# Altium schematic sheet Sheet1.SchDoc
size A; SheetNumber: 1; SheetTotal: 7
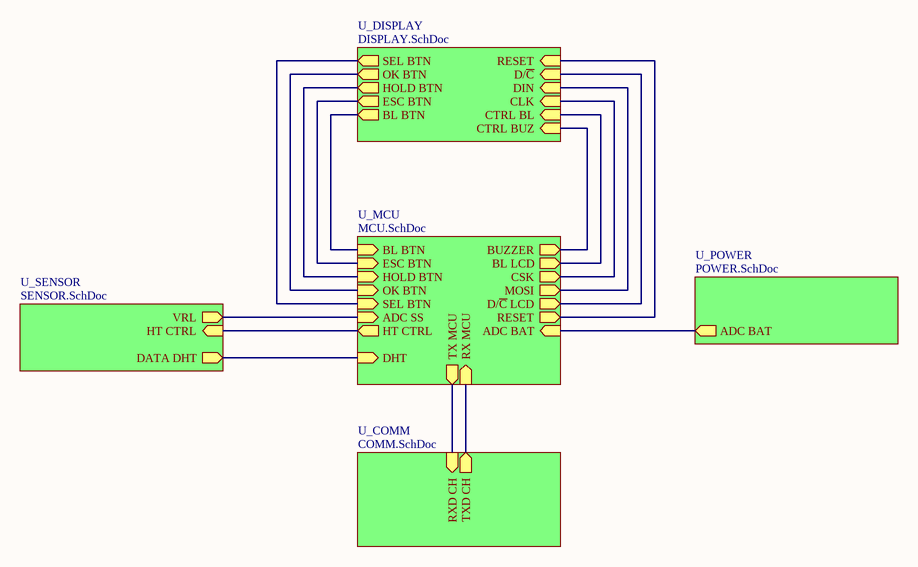
[diagram p0: Sheet1.SchDoc]

## Sub-sheets
U_COMM = COMM.SchDoc: TXD CH (out), RXD CH (in)
U_DISPLAY = DISPLAY.SchDoc: RESET (in), D/~{C} (in), DIN (in), CLK (in), BL BTN (out), ESC BTN (out), HOLD BTN (out), OK BTN (out), SEL BTN (out), CTRL BL (in), CTRL BUZ (in)
U_MCU = MCU.SchDoc: BL BTN (in), ESC BTN (in), HOLD BTN (in), OK BTN (in), SEL BTN (in), BL LCD (out), CSK (out), MOSI (out), D/~{C} LCD (out), ADC SS (in), ADC BAT (in), RESET (out), BUZZER (out), HT CTRL (out), TX MCU (out), RX MCU (in), DHT (in)
U_POWER = POWER.SchDoc: ADC BAT (out)
U_SENSOR = SENSOR.SchDoc: VRL (out), HT CTRL (in), DATA DHT (out)

## Nets
(unnamed): sheet U_POWER/ADC BAT, sheet U_MCU/ADC BAT
(unnamed): sheet U_SENSOR/VRL, sheet U_MCU/ADC SS
(unnamed): sheet U_SENSOR/HT CTRL, sheet U_MCU/HT CTRL
(unnamed): sheet U_SENSOR/DATA DHT, sheet U_MCU/DHT
(unnamed): sheet U_MCU/BL BTN, sheet U_DISPLAY/BL BTN
(unnamed): sheet U_MCU/ESC BTN, sheet U_DISPLAY/ESC BTN
(unnamed): sheet U_MCU/HOLD BTN, sheet U_DISPLAY/HOLD BTN
(unnamed): sheet U_MCU/OK BTN, sheet U_DISPLAY/OK BTN
(unnamed): sheet U_MCU/SEL BTN, sheet U_DISPLAY/SEL BTN
(unnamed): sheet U_MCU/BL LCD, sheet U_DISPLAY/CTRL BL
(unnamed): sheet U_MCU/CSK, sheet U_DISPLAY/CLK
(unnamed): sheet U_MCU/MOSI, sheet U_DISPLAY/DIN
(unnamed): sheet U_MCU/D/~{C} LCD, sheet U_DISPLAY/D/~{C}
(unnamed): sheet U_MCU/RESET, sheet U_DISPLAY/RESET
(unnamed): sheet U_MCU/BUZZER, sheet U_DISPLAY/CTRL BUZ
(unnamed): sheet U_MCU/TX MCU, sheet U_COMM/RXD CH
(unnamed): sheet U_MCU/RX MCU, sheet U_COMM/TXD CH